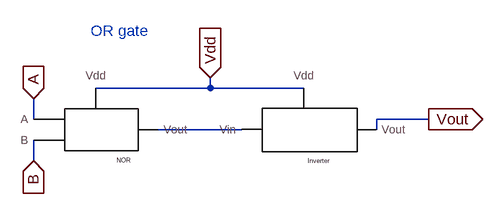
[diagram p0: schematic my_or.asc]
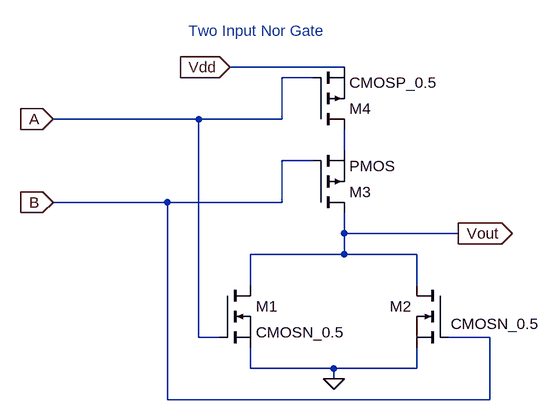
[diagram p1: sub-circuit my_nor.asc]
my_or.asc, the LTspice schematic file:
Version 4
SHEET 1 880 680
WIRE 288 144 288 128
WIRE 288 144 112 144
WIRE 432 144 288 144
WIRE 16 192 16 160
WIRE 624 192 544 192
WIRE 336 208 208 208
WIRE 544 208 544 192
WIRE 16 256 16 224
FLAG 16 160 A
IOPIN 16 160 In
FLAG 16 256 B
IOPIN 16 256 In
FLAG 288 128 Vdd
IOPIN 288 128 In
FLAG 624 192 Vout
IOPIN 624 192 Out
SYMBOL my_nor 112 208 R0
SYMATTR InstName NOR
SYMBOL my_inverter 432 208 R0
SYMATTR InstName Inverter
TEXT 104 56 Left 2 ;OR gate

my_nor.asc, the sub-circuit schematic file:
Version 4
SHEET 1 880 680
WIRE 336 -240 160 -240
WIRE 288 -224 240 -224
WIRE 112 -160 -112 -160
WIRE 240 -160 240 -224
WIRE 240 -160 112 -160
WIRE 336 -112 336 -144
WIRE 288 -96 240 -96
WIRE 64 -32 -112 -32
WIRE 240 -32 240 -96
WIRE 240 -32 64 -32
WIRE 336 16 336 -16
WIRE 512 16 336 16
WIRE 336 48 336 16
WIRE 336 48 192 48
WIRE 448 48 336 48
WIRE 192 96 192 48
WIRE 448 96 448 48
WIRE 112 176 112 -160
WIRE 144 176 112 176
WIRE 560 176 496 176
WIRE 192 224 192 192
WIRE 320 224 192 224
WIRE 448 224 448 192
WIRE 448 224 320 224
WIRE 320 240 320 224
WIRE 64 272 64 -32
WIRE 560 272 560 176
WIRE 560 272 64 272
FLAG -112 -32 B
IOPIN -112 -32 In
FLAG -112 -160 A
IOPIN -112 -160 In
FLAG 160 -240 Vdd
IOPIN 160 -240 In
FLAG 512 16 Vout
IOPIN 512 16 Out
FLAG 320 240 0
SYMBOL nmos 144 96 R0
SYMATTR InstName M1
SYMATTR Value CMOSN_0.5
SYMBOL nmos 496 96 M0
WINDOW 3 -141 59 Left 2
SYMATTR Value CMOSN_0.5
SYMATTR InstName M2
SYMBOL pmos 288 -144 M180
SYMATTR InstName M4
SYMATTR Value CMOSP_0.5
SYMBOL pmos 288 -16 M180
SYMATTR InstName M3
TEXT 96 -296 Left 2 ;Two Input Nor Gate

The netlist it stands for:
* my_or.asc
XNOR A B N001 Vdd my_nor
XInverter N001 Vdd Vout my_inverter  ; pins Vin Vdd Vout

* block symbol definitions
.subckt my_nor A B Vout Vdd
M1 Vout A 0 0 CMOSN_0.5
M2 Vout B 0 0 CMOSN_0.5
M4 N001 A Vdd Vdd CMOSP_0.5
M3 Vout B N001 N001 PMOS
* Two Input Nor Gate
.ends my_nor

.model NMOS NMOS
.model PMOS PMOS
.lib standard.mos
* OR gate
.backanno
.end